# EAGLE design RasPi-BplusHAT_CamSlot (EAGLE 7.1.0)
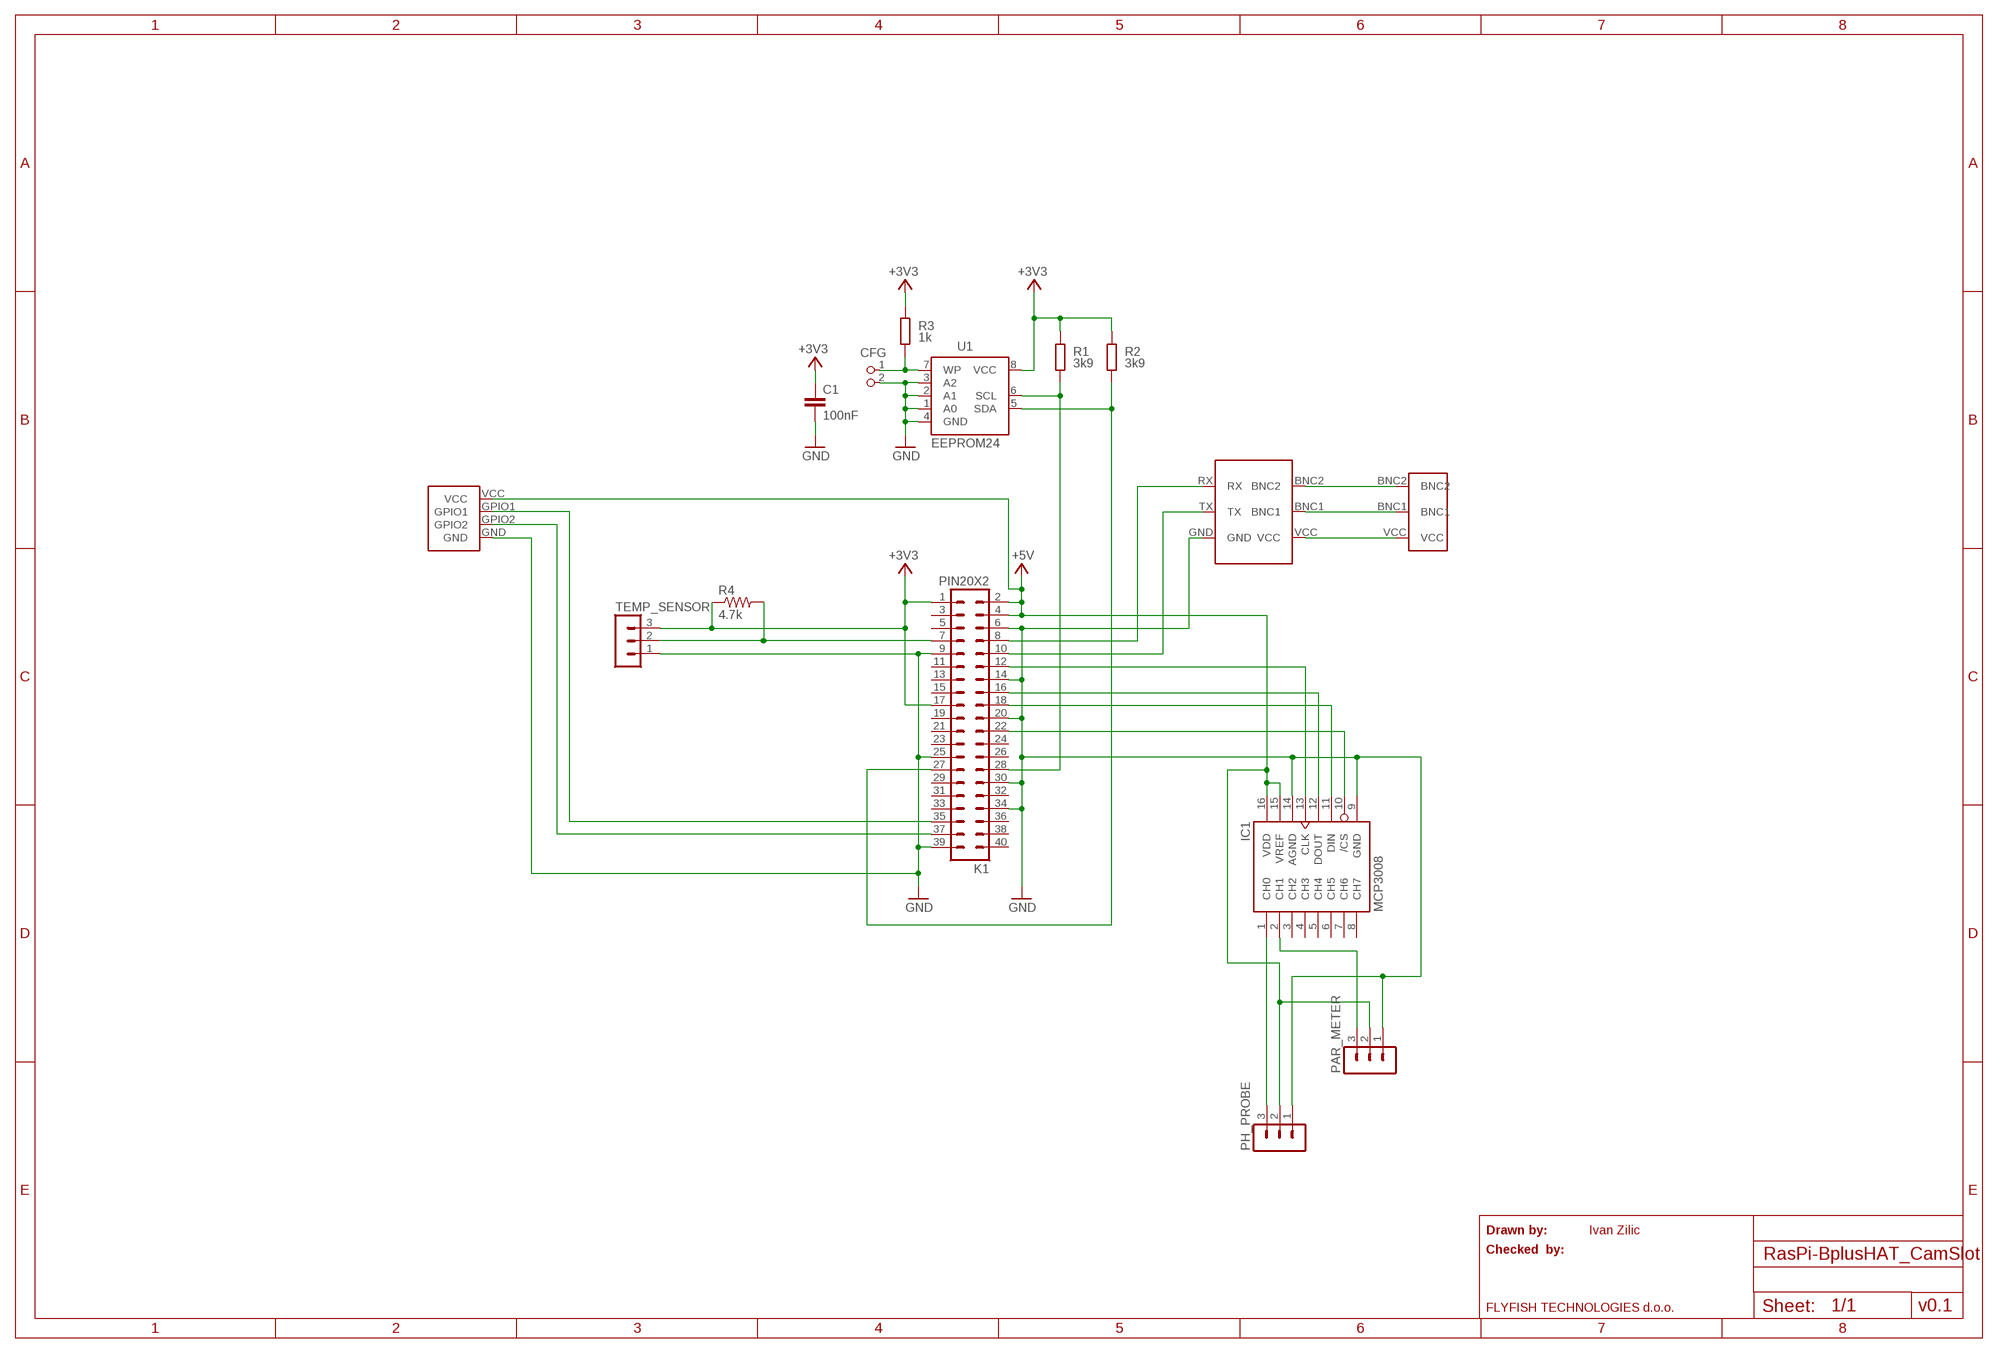
[diagram p0: schematic, sheet 1]

## Parts
C1  100nF  C-EUC0805K  [C0805K]
CFG  PIN2_100  [PIN_W_2]
IC1  MCP3008  [DIL16]
K1  PIN20X2  [PIN_20X2]
PAR_METER  MA03-1  [MA03-1]
PH_PROBE  MA03-1  [MA03-1]
R1  3k9  R-EU_M0805  [M0805]
R2  3k9  R-EU_M0805  [M0805]
R3  1k  R-EU_M0805  [M0805]
R4  4.7k  R-US_R0805  [R0805]
TEMP_SENSOR  MA03-1  [MA03-1]
U1  EEPROM24  [SOIC8]
U$1  MTA-156  [MTA-156_HEADER]
U$2  ATLAS_EC_CIRCUIT  [ATLAS_EC_CIRCUIT]
U$3  ATLAS_EC_PROBE  [ATLAS_EC_PROBE]

## Nets
+3V3: C1.1 K1.1 K1.17 R1.2 R2.2 R3.2 R4.1 TEMP_SENSOR.3 U1.8(VCC)
+5V: IC1.15(VREF) IC1.16(VDD) K1.2 K1.4 PAR_METER.2 PH_PROBE.2 U$1.VCC
GND: C1.2 CFG.2 IC1.9(GND) IC1.14(AGND) K1.6 K1.9 K1.14 K1.20 K1.25 K1.30 K1.34 K1.39 PAR_METER.1 PH_PROBE.1 TEMP_SENSOR.1 U1.1(A0) U1.2(A1) U1.3(A2) U1.4(GND) U$1.GND U$2.GND
N$1: K1.28 R1.1 U1.6(SCL)
N$2: K1.27 R2.1 U1.5(SDA)
N$3: CFG.1 R3.1 U1.7(WP)
N$4: K1.7 R4.2 TEMP_SENSOR.2
N$5: IC1.13(CLK) K1.12
N$6: IC1.12(DOUT) K1.16
N$7: IC1.11(DIN) K1.18
N$8: IC1.10(/CS) K1.22
N$9: IC1.1(CH0) PH_PROBE.3
N$10: U$2.BNC2 U$3.BNC2
N$11: U$2.BNC1 U$3.BNC1
N$12: U$2.VCC U$3.VCC
N$13: K1.8 U$2.RX
N$14: K1.10 U$2.TX
N$15: IC1.2(CH1) PAR_METER.3
N$16: K1.35 U$1.GPIO1
N$17: K1.37 U$1.GPIO2
Unconnected: IC1.3(CH2) IC1.4(CH3) IC1.5(CH4) IC1.6(CH5) IC1.7(CH6) IC1.8(CH7) K1.3 K1.5 K1.11 K1.13 K1.15 K1.19 K1.21 K1.23 K1.24 K1.26 K1.29 K1.31 K1.32 K1.33 K1.36 K1.38 K1.40

## Notes on the sheet
- Drawn by: | Ivan Zilic
- Checked  by:
- FLYFISH TECHNOLOGIES d.o.o. | v0.1

## Library data of the parts
C1 = resistor:C-EU: CAPACITOR, European symbol; DIELECTRIC: X7R
CFG = FLYFISH:PIN2
IC1 = adafruit:MCP3008
K1 = FLYFISH:PIN20X2
PAR_METER PH_PROBE TEMP_SENSOR = con-lstb:MA03-1: PIN HEADER; OC_FARNELL: unknown; OC_NEWARK: unknown
R1-R3 = resistor:R-EU_: RESISTOR, European symbol; TOLERANCE: 5%
R4 = adafruit:R-US_: RESISTOR, American symbol
U1 = FLYFISH:EEPROM24
U$1 = BloomWall:MTA-156: TE CONNECTIVITY / AMP 640445-4 - 4-wire to board connector Newark Part No.: 90F4055 Connector: Manufacturer Part No.: 3-640429-4 Newark Part No.: 87K2225
U$2 = BloomWall:ATLAS_EC_CIRCUIT
U$3 = BloomWall:ATLAS_EC_PROBE

## Net classes
0 default: width 0.305 mm, drill 0.508 mm, clearance 0.254 mm

## Board
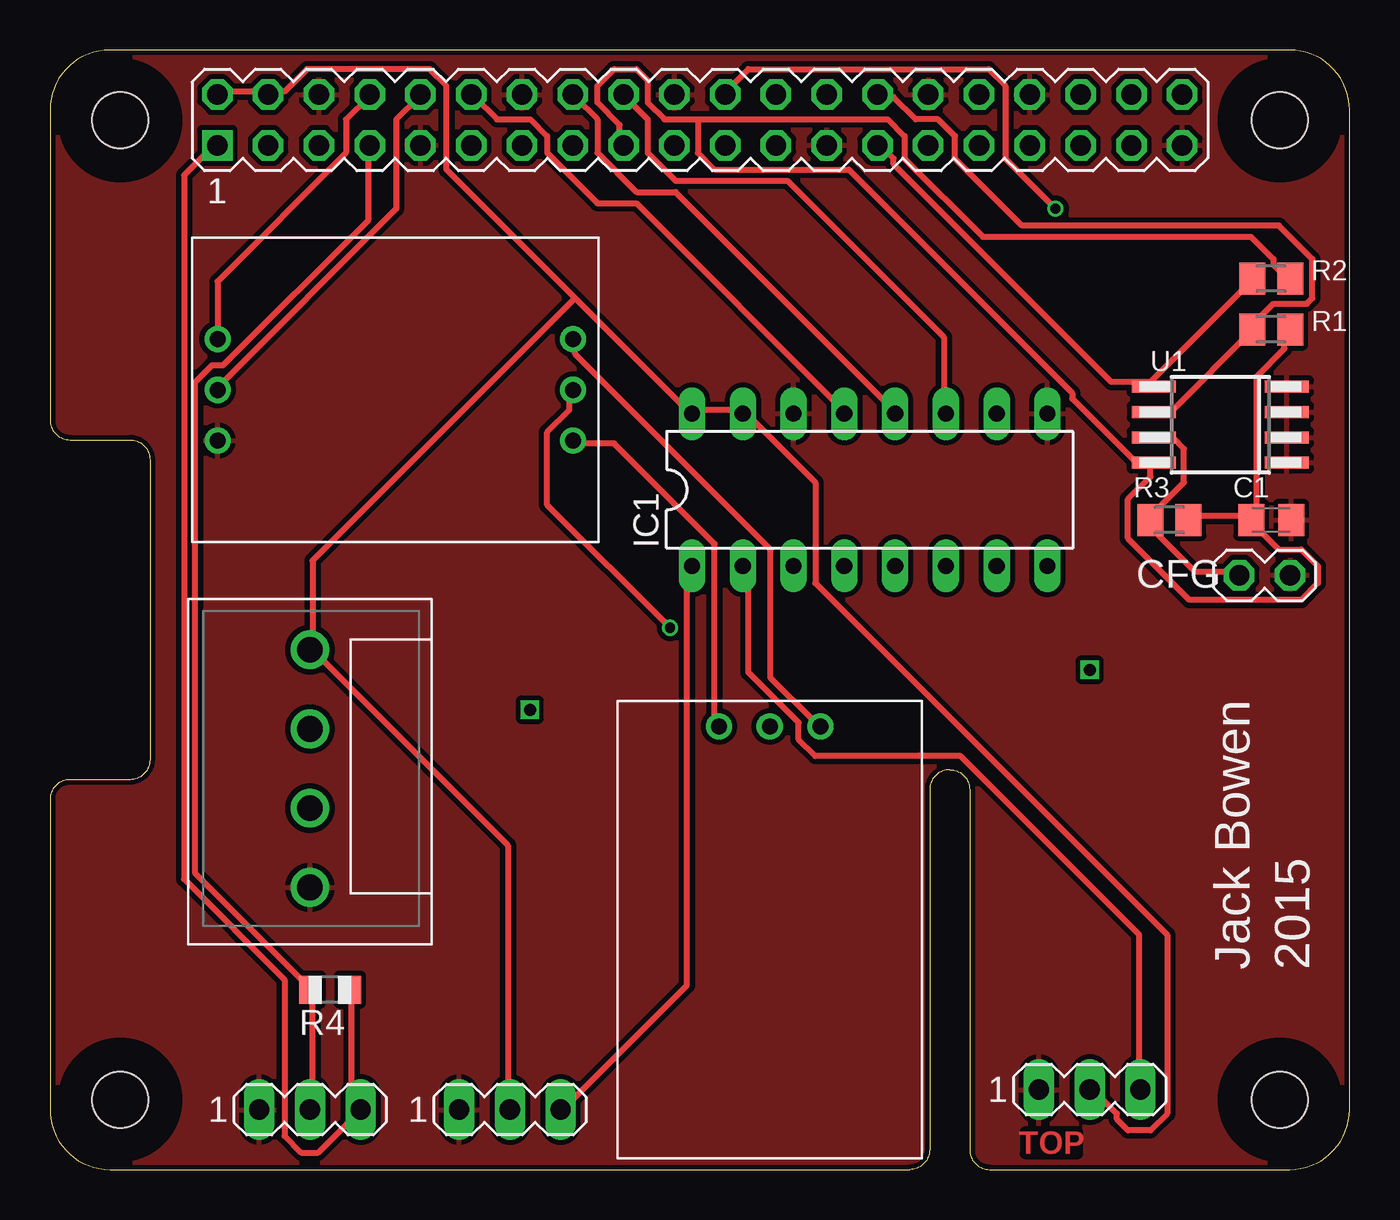
[diagram p1: board, top side]
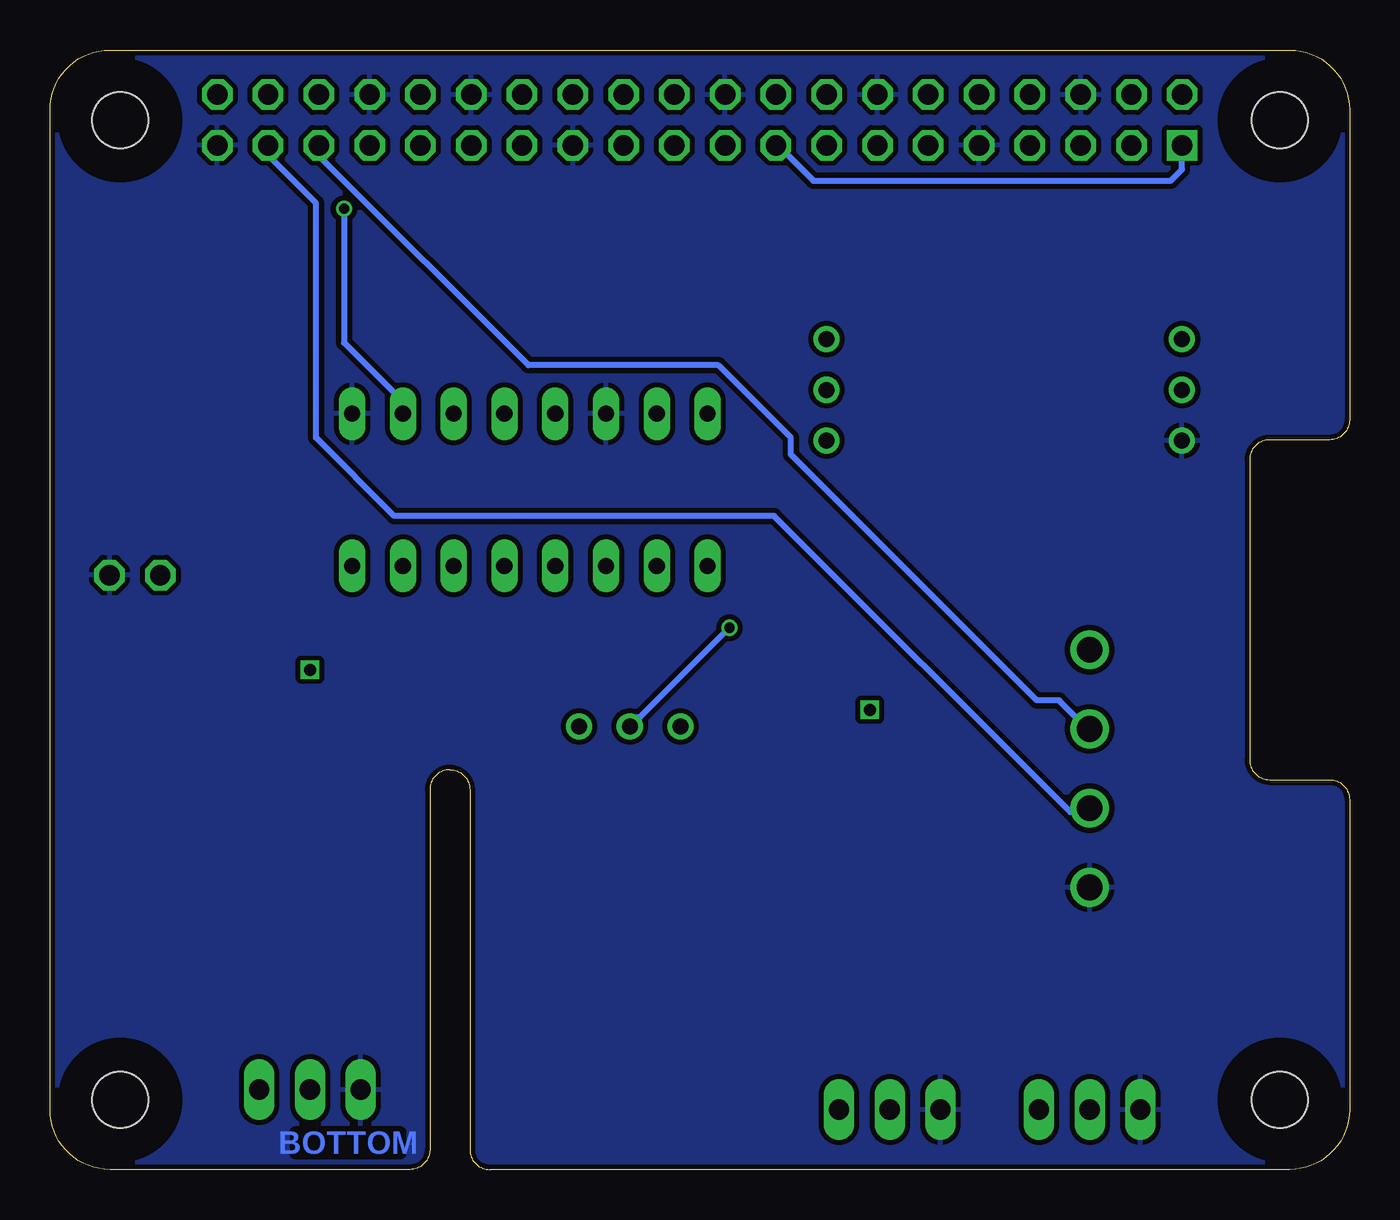
[diagram p2: board, bottom side, seen from below]

Size 65 x 56 mm. Coordinates in mm from the lower left corner, seen from the top.
Outline: 0,3 arc90 3,0 43,0 arc90 44,1 44,19 arc-90 45,20 arc-90 46,19 46,1 arc90 47,0 62,0 arc90 65,3 65,53 arc90 62,56 3,56 arc90 0,53 0,37.5 arc90 1,36.5 4,36.5 arc-90 5,35.5 5,20.5 arc-90 4,19.5 1,19.5 arc90 0,18.5 0,3
Copper layers (1*16): Top 0.035mm / dielectric 1.5mm / Bottom 0.035mm
Design rules "ITEADstudio_DRC": minimum track width 6mil, minimum drill 12mil, track to track 6mil, track to pad 6mil, pad to pad 6mil, via to via 6mil, smd to smd 0mil, copper to edge 10mil, drill to drill 10mil, minimum pad ring 10mil, minimum via ring 6mil, stop-mask expansion 2mil, vias tented up to drill 100mil, thermal gap 10mil
Holes 2.8 mm at 3.5,3.5 3.5,52.5 61.5,52.5 61.5,3.5
tRestrict: area 1.9,51 to 5,54; area 60,51 to 63,54; area 60,1.9 to 63,5; area 1.9,1.9 to 5,5
bRestrict: area 1.9,1.9 to 5,5; area 1.9,51 to 5,54; area 60,1.9 to 63,5; area 60,51 to 63,54

### Footprints (pad centres in the part's own frame; a part is rotated, then mirrored left to right if it is on the bottom)
C0805K = smd 1.3 x 1.6: 1 -1,0; 2 1,0
PIN_W_2 = drill 1.016 octagon: 1 0,0; 2 0,-2.54
DIL16 = drill 0.813 long: 1 -8.89,-3.81; 2 -6.35,-3.81; 3 -3.81,-3.81; 4 -1.27,-3.81; 5 1.27,-3.81; 6 3.81,-3.81; 7 6.35,-3.81; 8 8.89,-3.81; 9 8.89,3.81; 10 6.35,3.81; 11 3.81,3.81; 12 1.27,3.81; 13 -1.27,3.81; 14 -3.81,3.81; 15 -6.35,3.81; 16 -8.89,3.81
PIN_20X2 = drill 1.016 square: 1 -24.13,-1.27 | drill 1.016 octagon: 2 -24.13,1.27; 3 -21.59,-1.27; 4 -21.59,1.27; 5 -19.05,-1.27; 6 -19.05,1.27; 7 -16.51,-1.27; 8 -16.51,1.27; 9 -13.97,-1.27; 10 -13.97,1.27; 11 -11.43,-1.27; 12 -11.43,1.27; 13 -8.89,-1.27; 14 -8.89,1.27; 15 -6.35,-1.27; 16 -6.35,1.27; 17 -3.81,-1.27; 18 -3.81,1.27; 19 -1.27,-1.27; 20 -1.27,1.27; 21 1.27,-1.27; 22 1.27,1.27; 23 3.81,-1.27; 24 3.81,1.27; 25 6.35,-1.27; 26 6.35,1.27; 27 8.89,-1.27; 28 8.89,1.27; 29 11.43,-1.27; 30 11.43,1.27; 31 13.97,-1.27; 32 13.97,1.27; 33 16.51,-1.27; 34 16.51,1.27; 35 19.05,-1.27; 36 19.05,1.27; 37 21.59,-1.27; 38 21.59,1.27; 39 24.13,-1.27; 40 24.13,1.27
MA03-1 = drill 1.016 long: 1 -2.54,0; 2 0,0; 3 2.54,0
M0805 = smd 1.3 x 1.6: 1 -0.95,0; 2 0.95,0
R0805 = smd 1.1 x 1.4: 1 -1,0; 2 1,0
SOIC8 = smd 0.6 x 2.2: 1 -1.905,-3.33; 2 -0.635,-3.33; 3 0.635,-3.33; 4 1.905,-3.33; 5 1.905,3.33; 6 0.635,3.33; 7 -0.635,3.33; 8 -1.905,3.33
MTA-156_HEADER = drill 1.295: GND 11.887,0; GPIO1 3.962,0; GPIO2 7.925,0; VCC 0,0
ATLAS_EC_CIRCUIT = drill 0.8: BNC1 0,-10.16; BNC2 2.54,-10.16; GND -2.54,7.62; RX 2.54,7.62; TX 0,7.62; VCC -2.54,-10.16
ATLAS_EC_PROBE = drill 0.8: BNC1 0,10.16; BNC2 2.54,10.16; VCC -2.54,10.16

### Placement (x,y rotation side)
C1  61.08,32.5 0 top
CFG  59.48,29.73 90 top
IC1  41,34 0 top
K1  32.5,52.5 0 top
PAR_METER  52,4 0 top
PH_PROBE  23,3 0 top
R1  61.08,42.02 0 top
R2  61.08,44.56 0 top
R3  55.99,32.5 0 top
R4  14,9 180 top
TEMP_SENSOR  13,3 0 top
U1  58.53,37.26 90 top
U$1  13,26 270 top
U$2  16,39 90 top
U$3  36,12 0 top

### Tracks (layer width: path | path; a pad name or v marks a point on that pad's centre or on a via)
+3V3
  Top 0.305: R3.2 57,32.69 60.07,32.69 C1.1 | R1.2 61.75,41.91 61.75,41.07 60.35,39.67 60.35,32.69 C1.1 | C1.1 60.07,32.41 61.47,31.01 62.59,31.01 63.42,30.18 63.42,29.34 62.59,28.5 57,28.5 53.92,31.57 53.92,33.53 55.04,34.65 55.04,35.2 U1.8 55.04,35.48 54.2,35.48 51.13,38.56 51.13,38.84 39.95,50.01 33.25,50.01 32.41,50.85 32.41,52.53 | R4.1 15.09,8.94 15.09,3.35 15.37,3.07 TEMP_SENSOR.3 15.37,2.79 13.41,0.84 12.57,0.84 11.73,1.68 11.73,9.5 6.71,14.53 6.71,49.73 8.1,51.13 K1.1 | 32.41,52.53 30.73,52.53 29.9,53.37 29.9,54.48 29.34,55.04 28.22,55.04 27.38,54.2 27.38,53.37 28.5,52.25 28.5,51.41 K1.17 | 32.41,52.53 41.91,52.53 42.75,51.69 42.75,50.57 46.66,46.66 60.07,46.66 61.19,45.54 61.19,45.26 61.75,44.7 R2.2
  Bottom 0.305: K1.1 8.38,51.13 8.38,50.01 8.94,49.45 26.82,49.45 28.5,51.13 K1.17
+5V
  Top 0.305: PH_PROBE.2 22.91,3.07 22.91,16.2 13.13,25.98 U$1.VCC 13.13,26.26 13.13,30.45 26.26,43.59 | K1.2 8.38,53.92 10.9,53.92 K1.4 11.18,53.92 11.73,53.92 12.85,55.04 19,55.04 19.84,54.2 19.84,50.01 26.26,43.59 | PAR_METER.2 52.25,3.91 53.37,2.79 53.37,2.52 53.92,1.96 55.04,1.96 55.88,2.79 55.88,11.73 38.28,29.34 38.28,34.37 34.92,37.72 IC1.15 34.65,38 32.13,38 IC1.16 31.85,38 26.26,43.59
GND
  pour Bottom: 0,3 arc90 3,0 43,0 arc90 44,1 44,19 arc-90 45,20 arc-90 46,19 46,1 arc90 47,0 62,0 arc90 65,3 65,53 arc90 62,56 3,56 arc90 0,53 0,37.5 arc90 1,36.5 4,36.5 arc-90 5,35.5 5,20.5 arc-90 4,19.5 1,19.5 arc90 0,18.5
  pour Top: 0,3 arc90 3,0 43,0 arc90 44,1 44,19 arc-90 45,20 arc-90 46,19 46,1 arc90 47,0 62,0 arc90 65,3 65,53 arc90 62,56 3,56 arc90 0,53 0,37.5 arc90 1,36.5 4,36.5 arc-90 5,35.5 5,20.5 arc-90 4,19.5 1,19.5 arc90 0,18.5
N$1
  Top 0.305: U1.6 55.32,38 56.16,38 60.07,41.91 R1.1 60.07,42.19 61.19,43.31 62.87,43.31 63.14,43.59 63.14,45.54 61.47,47.22 48.62,47.22 45.26,50.57 45.26,51.69 44.42,52.53 43.31,52.53 42.19,53.65 41.63,53.65 K1.28
N$2
  Top 0.305: 55.04,39.4 60.07,44.42 R2.1 | 55.04,39.4 53.09,39.4 42.19,50.29 42.19,50.57 41.63,51.13 K1.27 | 55.04,39.4 U1.5
N$3
  Top 0.305: CFG.1 59.23,29.9 57.28,29.9 55.32,31.85 55.32,32.41 R3.1 55.04,32.69 56.72,34.37 56.72,36.04 56.16,36.6 55.32,36.6 U1.7
N$4
  Top 0.305: TEMP_SENSOR.2 13.13,3.07 13.13,8.94 R4.2 12.85,9.22 7.26,14.81 7.26,39.4 8.1,40.23 8.66,40.23 15.93,47.5 15.93,51.13 K1.7
N$5
  Top 0.305: IC1.13 39.67,38 29.34,48.34 27.38,48.34 24.87,50.85 24.87,51.69 24.03,52.53 22.35,52.53 21.23,53.65 K1.12
N$6
  Top 0.305: IC1.12 42.19,38 31.29,48.9 29.34,48.9 27.38,50.85 27.38,52.53 26.26,53.65 K1.16
N$7
  Top 0.305: IC1.11 44.7,38 44.7,41.63 36.88,49.45 31.29,49.45 29.9,50.85 29.9,52.53 28.78,53.65 K1.18
N$8  (via drill 0.51)
  Top 0.305: v50.29,48.06 47.78,50.57 47.78,54.2 46.94,55.04 34.92,55.04 33.81,53.92 K1.22
  Bottom 0.305: v50.29,48.06 50.29,41.35 47.5,38.56 47.5,38 IC1.10
N$9
  Top 0.305: IC1.1 31.85,30.18 31.85,9.22 25.7,3.07 PH_PROBE.3
N$10
  Top 0.305: U$2.BNC2 26.26,41.35 26.26,40.79 36.04,31.01 36.04,24.59 38.28,22.35 U$3.BNC2
N$11  (via drill 0.51)
  Top 0.305: v31.01,27.1 24.87,33.25 24.87,36.88 25.98,38 25.98,38.84 U$2.BNC1
  Bottom 0.305: v31.01,27.1 35.48,22.63 36.04,22.63 36.04,22.35 U$3.BNC1
N$12
  Top 0.305: U$2.VCC 26.26,36.32 28.22,36.32 33.25,31.29 33.25,22.35 U$3.VCC
N$13
  Top 0.305: U$2.RX 8.38,41.63 8.38,44.42 14.81,50.85 14.81,52.53 15.93,53.65 K1.8
N$14
  Top 0.305: U$2.TX 8.38,39.12 17.32,48.06 17.32,52.53 18.44,53.65 K1.10
N$15
  Top 0.305: IC1.2 34.92,30.18 34.92,24.87 37.44,22.35 37.44,21.51 38.28,20.68 45.54,20.68 54.48,11.73 54.48,4.19 PAR_METER.3
N$16
  Bottom 0.305: K1.35 51.41,51.13 51.41,50.57 41.07,40.23 31.57,40.23 27.94,36.6 27.94,35.76 15.65,23.47 14.53,23.47 13.13,22.07 U$1.GPIO1
N$17
  Bottom 0.305: K1.37 53.92,51.13 53.92,50.57 51.69,48.34 51.69,36.6 47.78,32.69 28.78,32.69 13.97,17.88 13.13,17.88 U$1.GPIO2
N$18  (via drill 0.6)
  other vias: 52,25
N$19  (via drill 0.6)
  other vias: 24,23

### Text on the board
Top: TOP
Bottom: BOTTOM
tPlace: Jack Bowen | 2015